# Altium schematic sheet Optocoupler_STM32_REVB.SchDoc
size A4; SheetNumber: 2; SheetTotal: 2
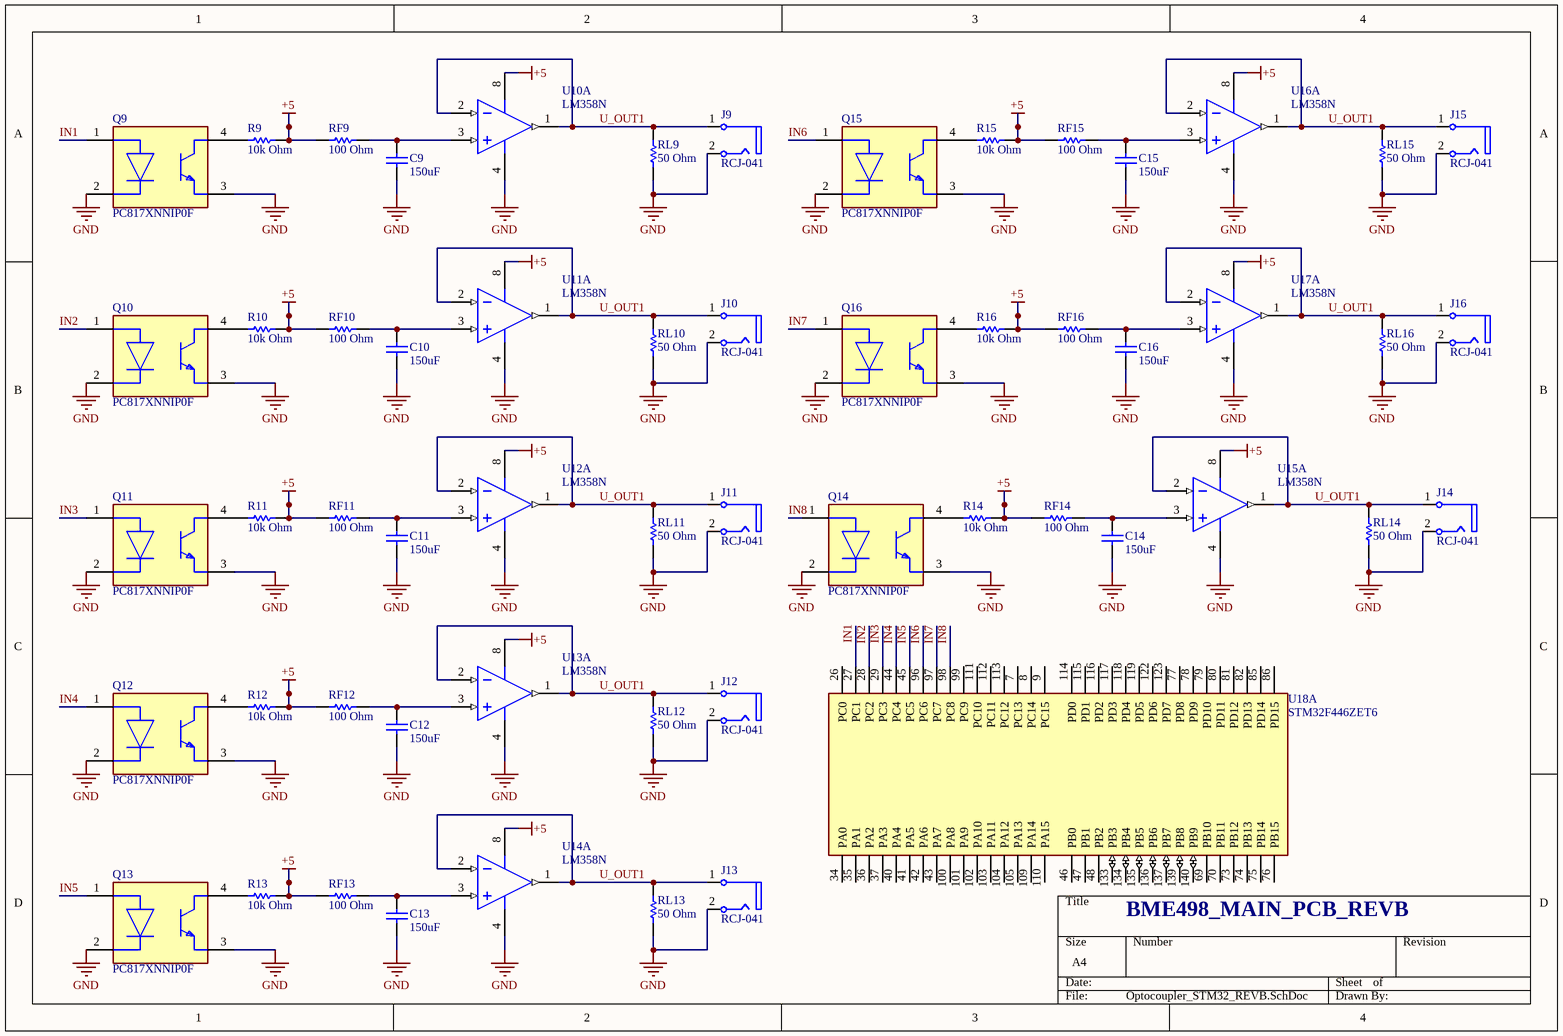
[diagram p0: Optocoupler_STM32_REVB.SchDoc]

## Parts
C9  value 150uF  [RADIAL-0.1]
C10  value 150uF  [RADIAL-0.1]
C11  value 150uF  [RADIAL-0.1]
C12  value 150uF  [RADIAL-0.1]
C13  value 150uF  [RADIAL-0.1]
C14  value 150uF  [RADIAL-0.1]
C15  value 150uF  [RADIAL-0.1]
C16  value 150uF  [RADIAL-0.1]
J9  RCJ-041  [CUI-RCJ-041_V]
J10  RCJ-041  [CUI-RCJ-041_V]
J11  RCJ-041  [CUI-RCJ-041_V]
J12  RCJ-041  [CUI-RCJ-041_V]
J13  RCJ-041  [CUI-RCJ-041_V]
J14  RCJ-041  [CUI-RCJ-041_V]
J15  RCJ-041  [CUI-RCJ-041_V]
J16  RCJ-041  [CUI-RCJ-041_V]
Q9  PC817XNNIP0F  [FP-PC817XNNIP0F-MFG]
Q10  PC817XNNIP0F  [FP-PC817XNNIP0F-MFG]
Q11  PC817XNNIP0F  [FP-PC817XNNIP0F-MFG]
Q12  PC817XNNIP0F  [FP-PC817XNNIP0F-MFG]
Q13  PC817XNNIP0F  [FP-PC817XNNIP0F-MFG]
Q14  PC817XNNIP0F  [FP-PC817XNNIP0F-MFG]
Q15  PC817XNNIP0F  [FP-PC817XNNIP0F-MFG]
Q16  PC817XNNIP0F  [FP-PC817XNNIP0F-MFG]
R9  value 10k Ohm  [AXIAL-0.3]
R10  value 10k Ohm  [AXIAL-0.3]
R11  value 10k Ohm  [AXIAL-0.3]
R12  value 10k Ohm  [AXIAL-0.3]
R13  value 10k Ohm  [AXIAL-0.3]
R14  value 10k Ohm  [AXIAL-0.3]
R15  value 10k Ohm  [AXIAL-0.3]
R16  value 10k Ohm  [AXIAL-0.3]
RF9  value 100 Ohm  [AXIAL-0.3]
RF10  value 100 Ohm  [AXIAL-0.3]
RF11  value 100 Ohm  [AXIAL-0.3]
RF12  value 100 Ohm  [AXIAL-0.3]
RF13  value 100 Ohm  [AXIAL-0.3]
RF14  value 100 Ohm  [AXIAL-0.3]
RF15  value 100 Ohm  [AXIAL-0.3]
RF16  value 100 Ohm  [AXIAL-0.3]
RL9  value 50 Ohm  [AXIAL-0.3]
RL10  value 50 Ohm  [AXIAL-0.3]
RL11  value 50 Ohm  [AXIAL-0.3]
RL12  value 50 Ohm  [AXIAL-0.3]
RL13  value 50 Ohm  [AXIAL-0.3]
RL14  value 50 Ohm  [AXIAL-0.3]
RL15  value 50 Ohm  [AXIAL-0.3]
RL16  value 50 Ohm  [AXIAL-0.3]
U10  LM358N  [ONSC-PDIP-8-626-05_M]  (part A of 2)
U11  LM358N  [ONSC-PDIP-8-626-05_M]  (part A of 2)
U12  LM358N  [ONSC-PDIP-8-626-05_M]  (part A of 2)
U13  LM358N  [ONSC-PDIP-8-626-05_M]  (part A of 2)
U14  LM358N  [ONSC-PDIP-8-626-05_M]  (part A of 2)
U15  LM358N  [ONSC-PDIP-8-626-05_M]  (part A of 2)
U16  LM358N  [ONSC-PDIP-8-626-05_M]  (part A of 2)
U17  LM358N  [ONSC-PDIP-8-626-05_M]  (part A of 2)
U18  STM32F446ZET6  [FP-STM32F446ZET6-MFG]  (part A of 3)

## Nets
+5: R9.2 R10.2 R11.2 R12.2 R13.2 R14.2 R15.2 R16.2 RF9.1 RF10.1 RF11.1 RF12.1 RF13.1 RF14.1 RF15.1 RF16.1 U10.8(VCC) U11.8(VCC) U12.8(VCC) U13.8(VCC) U14.8(VCC) U15.8(VCC) U16.8(VCC) U17.8(VCC)
GND: C9.1 C10.1 C11.1 C12.1 C13.1 C14.1 C15.1 C16.1 J9.2 J10.2 J11.2 J12.2 J13.2 J14.2 J15.2 J16.2 Q9.2(C) Q9.3(E) Q10.2(C) Q10.3(E) Q11.2(C) Q11.3(E) Q12.2(C) Q12.3(E) Q13.2(C) Q13.3(E) Q14.2(C) Q14.3(E) Q15.2(C) Q15.3(E) Q16.2(C) Q16.3(E) RL9.1 RL10.1 RL11.1 RL12.1 RL13.1 RL14.1 RL15.1 RL16.1 U10.4(VEE/GND) U11.4(VEE/GND) U12.4(VEE/GND) U13.4(VEE/GND) U14.4(VEE/GND) U15.4(VEE/GND) U16.4(VEE/GND) U17.4(VEE/GND)
IN1: Q9.1(A) U18.27(PC1)
IN2: Q10.1(A) U18.28(PC2)
IN3: Q11.1(A) U18.29(PC3)
IN4: Q12.1(A) U18.44(PC4)
IN5: Q13.1(A) U18.45(PC5)
IN6: Q15.1(A) U18.96(PC6)
IN7: Q16.1(A) U18.97(PC7)
IN8: Q14.1(A) U18.98(PC8)
U_OUT1: J9.1 J10.1 J11.1 J12.1 J13.1 J14.1 J15.1 J16.1 RL9.2 RL10.2 RL11.2 RL12.2 RL13.2 RL14.2 RL15.2 RL16.2 U10.1(OUTA) U10.2(INA-) U11.1(OUTA) U11.2(INA-) U12.1(OUTA) U12.2(INA-) U13.1(OUTA) U13.2(INA-) U14.1(OUTA) U14.2(INA-) U15.1(OUTA) U15.2(INA-) U16.1(OUTA) U16.2(INA-) U17.1(OUTA) U17.2(INA-)
NetC9_2: C9.2 RF9.2 U10.3(INA+)
NetC10_2: C10.2 RF10.2 U11.3(INA+)
NetC11_2: C11.2 RF11.2 U12.3(INA+)
NetC12_2: C12.2 RF12.2 U13.3(INA+)
NetC13_2: C13.2 RF13.2 U14.3(INA+)
NetC14_2: C14.2 RF14.2 U15.3(INA+)
NetC15_2: C15.2 RF15.2 U16.3(INA+)
NetC16_2: C16.2 RF16.2 U17.3(INA+)
NetQ9_4: Q9.4(C) R9.1
NetQ10_4: Q10.4(C) R10.1
NetQ11_4: Q11.4(C) R11.1
NetQ12_4: Q12.4(C) R12.1
NetQ13_4: Q13.4(C) R13.1
NetQ14_4: Q14.4(C) R14.1
NetQ15_4: Q15.4(C) R15.1
NetQ16_4: Q16.4(C) R16.1

Not connected (* = marked no-connect by the designer): U18 7(PC13) 8(PC14) 9(PC15) 26(PC0) 34(PA0) 35(PA1) 36(PA2) 37(PA3) 40(PA4) 41(PA5) 42(PA6) 43(PA7) 46(PB0) 47(PB1) 48(PB2) 69(PB10) 70(PB11) 73(PB12) 74(PB13) 75(PB14) 76(PB15) 77(PD8) 78(PD9) 79(PD10) 80(PD11) 81(PD12) 82(PD13) 85(PD14) 86(PD15) 99(PC9) 100(PA8) 101(PA9) 102(PA10) 103(PA11) 104(PA12) 105(PA13) 109(PA14) 110(PA15) 111(PC10) 112(PC11) 113(PC12) 114(PD0) 115(PD1) 116(PD2) 117(PD3) 118(PD4) 119(PD5) 122(PD6) 123(PD7) 133(PB3) 134(PB4) 135(PB5) 136(PB6) 137(PB7) 139(PB8) 140(PB9)

## Notes on the sheet
- (near U18) BME498_MAIN_PCB_REVB

## Library data of the parts
C9-C16 = CAP ALUM 15UF 20% 16V RADIAL: Capacitor; Manufacturer Part Number: EEA-GA1C150B; Designator: C?; Voltage Rating: 16V; Published: 8-Jun-2000; LatestRevisionDate: 17-Jul-2002; LatestRevisionNote: Re-released for DXP Platform.; Publisher: Altium Limited
J9-J16 = CMP-1692-00002-1: Female RCJ Jack, 2 Position, Height 11.724 mm, Tail Length 4 mm, RoHS, Bulk; Case\Package: Metal; Connector Type: HDMI; Current Rating: 500 mA; Voltage Rating: 40 V; Length: 16.2 mm; Pins: 19; ComponentLink1URL: http://www.cui.com/; ComponentLink1Description: Manufacturer URL; Packaging: Tape and Reel; Lead Pitch: 0.5 mm; PackageDescription: Female RCJ Jack, 2 Position, Height 11.724 mm, Tail Length 4 mm; RoHSCompliant: true; Min Operating Temperature: -55 degC; Height: 6.1 mm; Contact Material: Copper; REACH SVHC: No SVHC; DatasheetVersion: Rev. B, 02/2012; ComponentLink2Description: Datasheet; Contact Plating: Gold; Colour: Black; Max Operating Temperature: 85 degC; Mount: Surface Mount; Package Quantity: 400; Gender: Female; ComponentLink2URL: http://www.cui.com/product/resource/rcj-04x.pdf; PackageReference: RCJ-041
Q9-Q16 = CMP-65434-000005-1: OPTOISOLATOR 5KV TRANS 4SMD; Reverse Breakdown Voltage: 6V; Output Current per Channel: 30mA; Power Dissipation: 200mW; Collector-emitter Voltage-Max: 200mV; Max Output Voltage: 80V; Input Current: 50mA; Forward Voltage: 1.4V; Fall Time: 18000ns; Number of Elements: 1; Input Type: DC; Packaging: Tape and Reel; RoHS Compliant: Yes; Contact Plating: Copper; Min Operating Temperature: -30°C; Collector Emitter Saturation Voltage: 200mV; Max Input Current: 50mA; Radiation Hardening: No; Max Collector Current: 50mA; Case/Package: SMD/SMT; Mount: Surface Mount; Output Voltage: 80V; Forward Current: 50mA; Max Power Dissipation: 200mW; Collector Emitter Voltage (VCEO): 80V; Number of Channels: 1; Rise Time: 18000ns; Isolation Voltage: 5kV; Number of Pins: 4; Lead Free: Lead Free; Package Quantity: 2000; Isolation Voltage-Max: 5kV; Max Operating Temperature: 100°C
R9-R16 RF9-RF16 RL9-RL16 = RES 10 OHM 5% 1/4W AXIAL: Resistor; Manufacturer Part Number: CFR-25JB-52-10R; Designator: R?; Power Rating: 1/4W; Tolerance: 0.05; Published: 8-Jun-2000; LatestRevisionDate: 17-Jul-2002; LatestRevisionNote: Re-released for DXP Platform.; Publisher: Altium Limited
U10-U17 = CMP-1310-00098-1: Single Supply Dual Operational Amplifier, 3 to 32 V, 0 to 70 degC, 8-Pin PDIP, Tube; Manufacturer: On Semiconductor; VCC Max (V): 32; VCC Min (V): 3; Mounting Technology: Through Hole; ComponentLink3Description: Package Specification; ComponentLink3URL: http://www.onsemi.com/pub_link/Collateral/LM211-D.PDF; RoHS: FALSE; Packing: Tube; PackageDescription: 8-Pin Plastic Dual-In Line Package, Body 9.52 x 6.605 mm, Pitch 2.54 mm; PackageReference: PDIP-8-626-05; PackageVersion: Rev. M, 04/2010; PartNumber: LM358N; ComponentLink2Description: Datasheet; ComponentLink2URL: http://www.onsemi.cn/pub_link/Collateral/LM358-D.PDF; ComponentLink1URL: http://www.onsemi.com/; ComponentLink1Description: Manufacturer URL; DatasheetVersion: Rev. 27
U18 = CMP-12105-000067-1: IC MCU 32BIT 512KB FLASH 144LQFP; Manufacturer: STMicroelectronics; Standoff Height: 0.05mm; Memory Size: 512KBytes; Data Bus Width: 32bits; Number Of Timers/Counters: 14; Number Of I2C Channels: 4; Number Of Usb Channels: 2; Frequency: 180MHz; Ram Size: 128KBytes; Number Of I/Os: 114; Min Supply Voltage: 1.7V; Max Junction Temp: +105°C; Number Of Cores: 1; Core Architecture: Arm Cortex-M4; Max Supply Voltage: 3.6V; Number Of Adc Channels: 24; Number Of Pwm Channels: 32; Number Of Uart Channels: 6; Number Of A/D Converters: 3; Interface: I2C,SPI,UART,USART,EBI/EMI,CAN,USB,LIN,IrDA,I2S,SMBus,Other; Mouser Description: 32 Bit Microcontroller, High Performance, Arm Cortex-M4, 180 Mhz, 512 Kb, 128 Kb, 144, Lqfp; Temperature Range High: +105°C; Device Class L3: Microcontrollers; Ambient Temperature Range High: +85°C; Lead Free: Yes; Octopart: https://octopart.com/stm32f446zet6-stmicroelectronics-52642927; Device Class L2: Embedded Processors and Controllers; Height: 1.6mm; Category: IC; Manufacturer Part Number: STM32F446ZET6; RoHS: TRUE; Memory Type: FLASH; Temperature: -40°C to +105°C; Number Of Spi Channels: 4; Device Class L1: Integrated Circuits (ICs); Package: LQFP144; Digikey Description: IC MCU 32BIT 512KB FLASH 144LQFP; Automotive: No; ComponentLink2Description: Datasheet; ComponentLink2URL: https://www.st.com/content/ccc/resource/technical/document/datasheet/65/cb/75/50/53/d6/48/24/DM00141306.pdf/files/DM00141306.pdf/jcr:content/translations/en.DM00141306.pdf; Ambient Temperature Range Low: -40°C; Temperature Range Low: -40°C